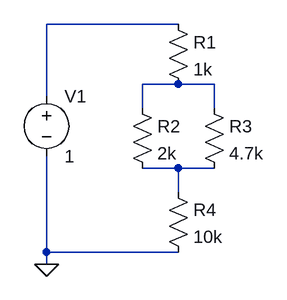
[diagram p0: schematic ladder_resistor_network.asc]
ladder_resistor_network.asc, the LTspice schematic file:
Version 4
SHEET 1 880 680
WIRE 256 -48 80 -48
WIRE 256 32 208 32
WIRE 304 32 256 32
WIRE 80 48 80 -48
WIRE 208 64 208 32
WIRE 304 64 304 32
WIRE 256 144 208 144
WIRE 304 144 256 144
WIRE 256 176 256 144
WIRE 80 256 80 128
WIRE 256 256 80 256
WIRE 80 272 80 256
FLAG 80 272 0
SYMBOL voltage 80 32 R0
WINDOW 123 0 0 Left 0
WINDOW 39 0 0 Left 0
SYMATTR InstName V1
SYMATTR Value 1
SYMBOL res 240 -64 R0
SYMATTR InstName R1
SYMATTR Value 1k
SYMBOL res 192 48 R0
SYMATTR InstName R2
SYMATTR Value 2k
SYMBOL res 288 48 R0
SYMATTR InstName R3
SYMATTR Value 4.7k
SYMBOL res 240 160 R0
SYMATTR InstName R4
SYMATTR Value 10k

The netlist it stands for:
* ladder_resistor_network.asc
V1 N001 0 1
R1 N001 N002 1k
R2 N002 N003 2k
R3 N002 N003 4.7k
R4 N003 0 10k
.backanno
.end